# EAGLE design oresat0-mezzanine (EAGLE 9.6.2)

## Sheet 1 of 2: UHF
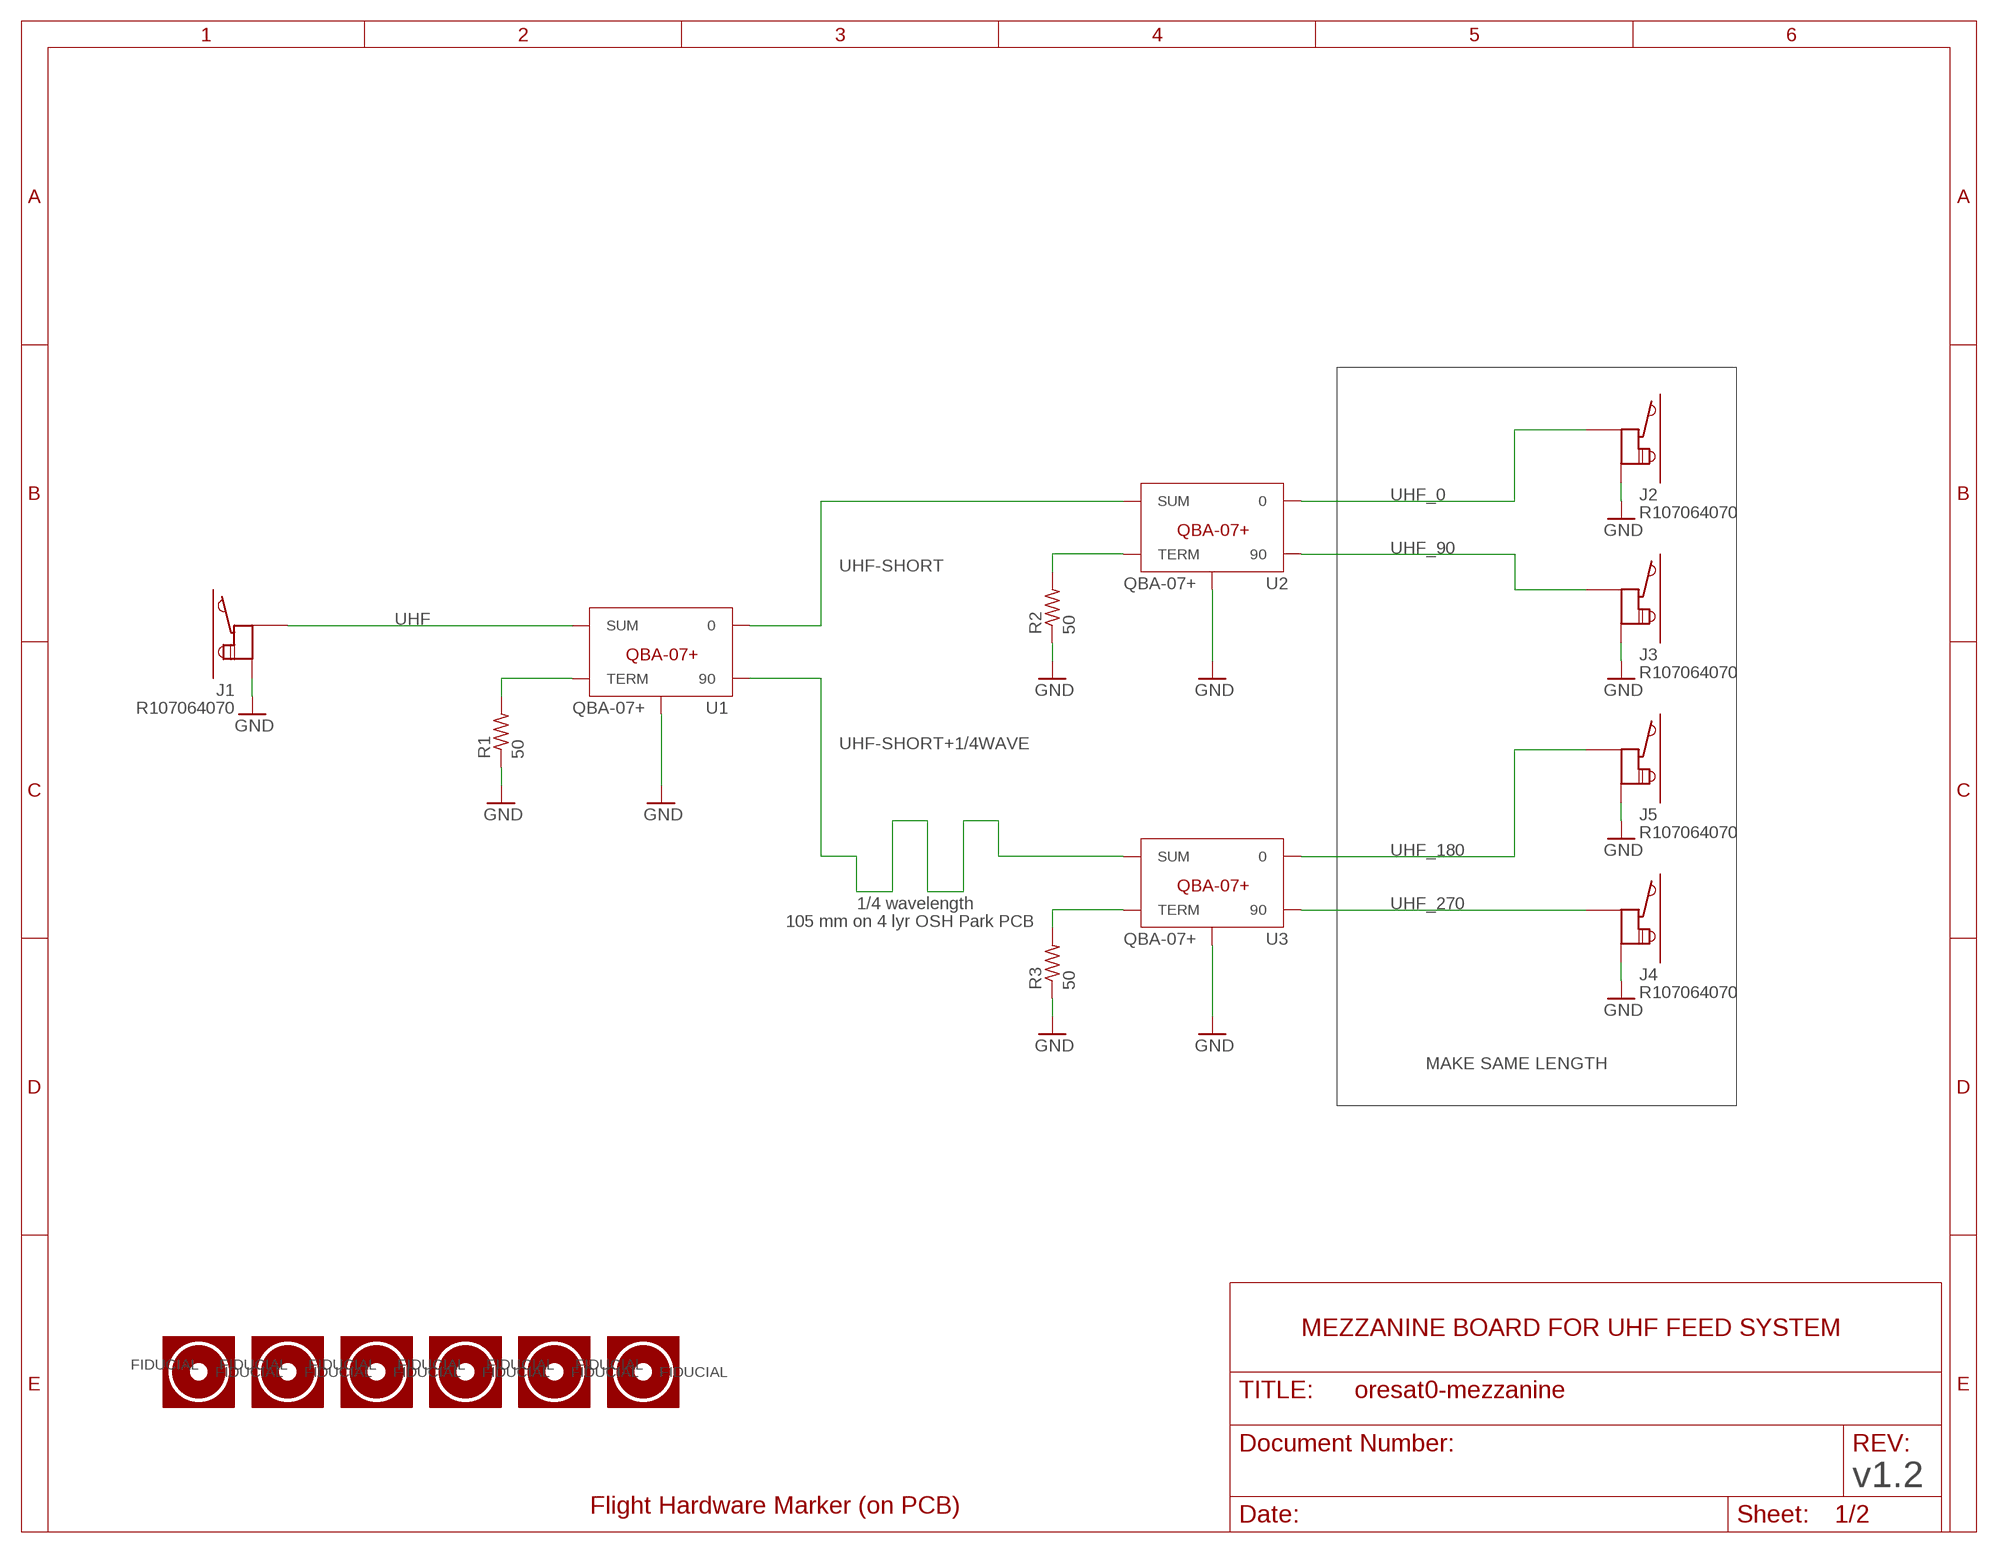
[diagram p0: schematic, sheet 1]

### Parts
FIDUCIAL1  FIDUCIAL-1.0X2.0  [FIDUCIAL-1.0X2.0]
FIDUCIAL2  FIDUCIAL-1.0X2.0  [FIDUCIAL-1.0X2.0]
FIDUCIAL3  FIDUCIAL-1.0X2.0  [FIDUCIAL-1.0X2.0]
FIDUCIAL4  FIDUCIAL-1.0X2.0  [FIDUCIAL-1.0X2.0]
FIDUCIAL6  FIDUCIAL-1.0X2.0  [FIDUCIAL-1.0X2.0]
FIDUCIAL7  FIDUCIAL-1.0X2.0  [FIDUCIAL-1.0X2.0]
J1  R107064070  [R107064070_SOLDER]
J2  R107064070  [R107064070_SOLDER]
J3  R107064070  [R107064070_SOLDER]
J4  R107064070  [R107064070_SOLDER]
J5  R107064070  [R107064070_SOLDER]
R1  50  R-US_0603-C-NOSILK  [.0603-C-NOSILK]
R2  50  R-US_0603-C-NOSILK  [.0603-C-NOSILK]
R3  50  R-US_0603-C-NOSILK  [.0603-C-NOSILK]
U1  QBA-07+  [QBA-07+]
U2  QBA-07+  [QBA-07+]
U3  QBA-07+  [QBA-07+]
U$1  FLIGHMARKERNEW  [FLIGHTMARKER_NEW_BOARDS]

### Nets
GND: J1.P$2 J1.P$3 J2.P$2 J2.P$3 J3.P$2 J3.P$3 J4.P$2 J4.P$3 J5.P$2 J5.P$3 R1.1 R2.1 R3.1 U1.2(GND) U1.3(GND) U1.4(GND) U1.7(GND) U1.8(GND) U1.9(GND) U1.GND-NO-PAD(GND) U2.2(GND) U2.3(GND) U2.4(GND) U2.7(GND) U2.8(GND) U2.9(GND) U2.GND-NO-PAD(GND) U3.2(GND) U3.3(GND) U3.4(GND) U3.7(GND) U3.8(GND) U3.9(GND) U3.GND-NO-PAD(GND) ; also sheet 2
N$3: R1.2 U1.5(TERM)
N$4: R2.2 U2.5(TERM)
N$6: R3.2 U3.5(TERM)
UHF [RF]: J1.P$1 U1.1(SUM)
UHF-SHORT [RF]: U1.6 U2.1(SUM)
UHF-SHORT+1/4WAVE [RF]: U1.10 U3.1(SUM)
UHF_0 [RF]: J2.P$1 U2.6
UHF_90 [RF]: J3.P$1 U2.10
UHF_180 [RF]: J5.P$1 U3.6
UHF_270 [RF]: J4.P$1 U3.10
Unconnected: FIDUCIAL1.FIDUCIAL FIDUCIAL2.FIDUCIAL FIDUCIAL3.FIDUCIAL FIDUCIAL4.FIDUCIAL FIDUCIAL6.FIDUCIAL FIDUCIAL7.FIDUCIAL

### Notes on the sheet
- 1/4 wavelength
- 105 mm on 4 lyr OSH Park PCB
- MAKE SAME LENGTH
- MEZZANINE BOARD FOR UHF FEED SYSTEM
- v1.2

## Sheet 2 of 2: S BAND
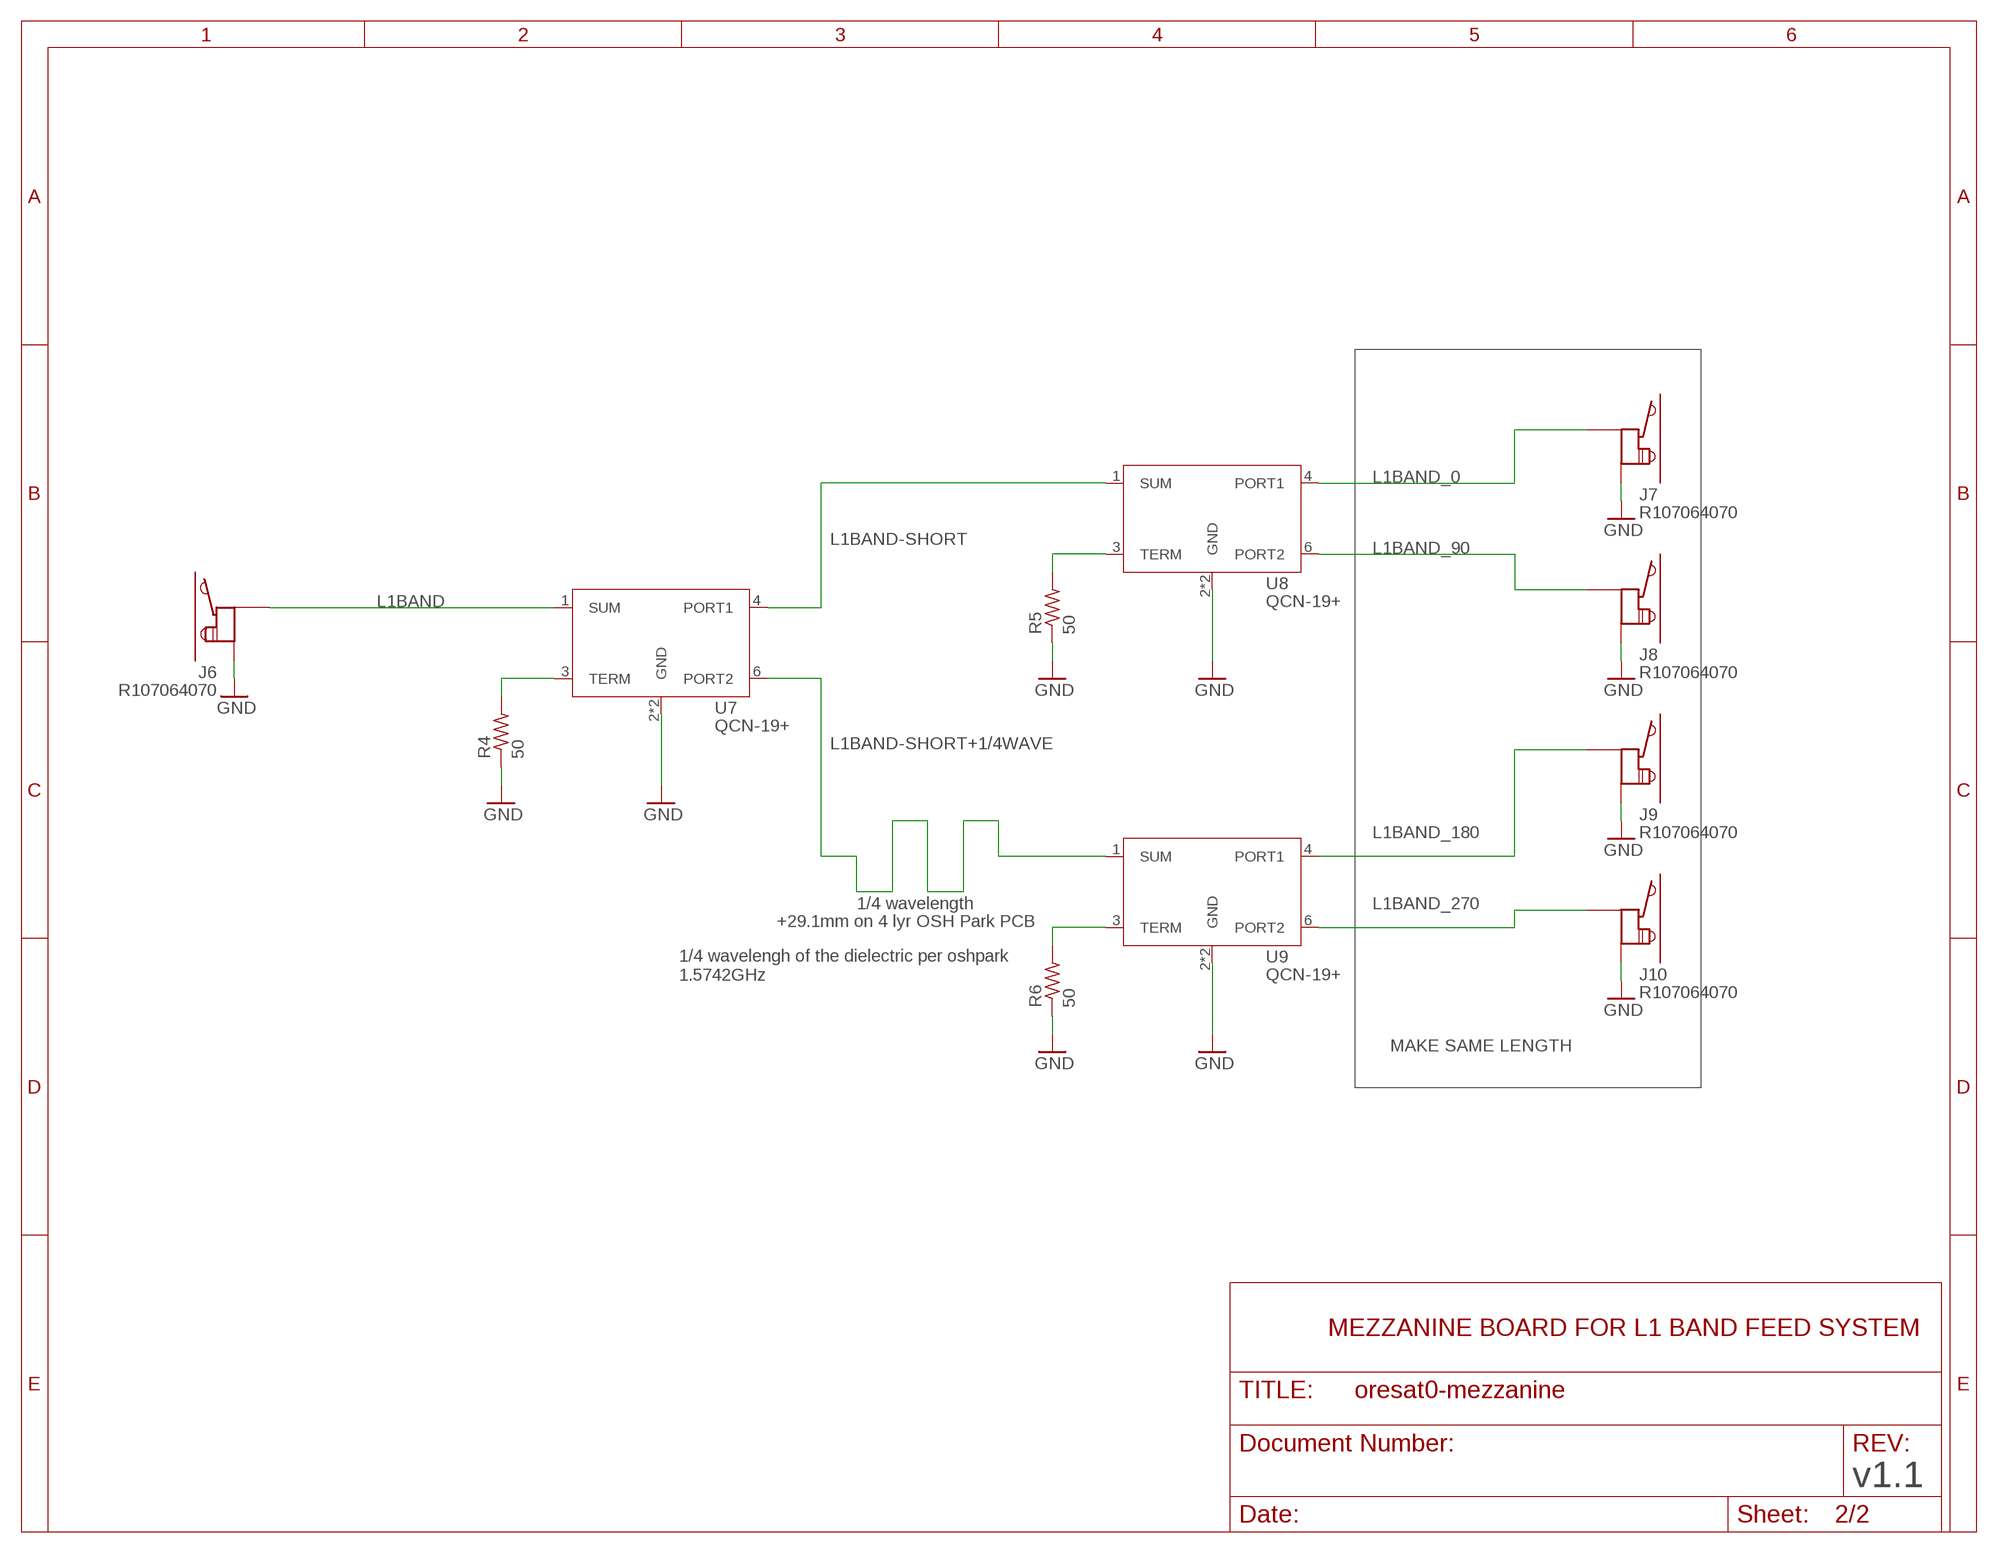
[diagram p1: schematic, sheet 2]

### Parts
J6  R107064070  [R107064070_SOLDER]
J7  R107064070  [R107064070_SOLDER]
J8  R107064070  [R107064070_SOLDER]
J9  R107064070  [R107064070_SOLDER]
J10  R107064070  [R107064070_SOLDER]
R4  50  R-US_0603-C-NOSILK  [.0603-C-NOSILK]
R5  50  R-US_0603-C-NOSILK  [.0603-C-NOSILK]
R6  50  R-US_0603-C-NOSILK  [.0603-C-NOSILK]
U7  QCN-19+  QCN-XXX+  [QCN-XXX+]
U8  QCN-19+  QCN-XXX+  [QCN-XXX+]
U9  QCN-19+  QCN-XXX+  [QCN-XXX+]

### Nets
GND: J6.P$2 J6.P$3 J7.P$2 J7.P$3 J8.P$2 J8.P$3 J9.P$2 J9.P$3 J10.P$2 J10.P$3 R4.1 R5.1 R6.1 U7.2(GND) U7.5(GND) U8.2(GND) U8.5(GND) U9.2(GND) U9.5(GND) ; also sheet 1
L1BAND [RF]: J6.P$1 U7.1(SUM)
L1BAND-SHORT [RF]: U7.4(PORT1) U8.1(SUM)
L1BAND-SHORT+1/4WAVE [RF]: U7.6(PORT2) U9.1(SUM)
L1BAND_0 [RF]: J7.P$1 U8.4(PORT1)
L1BAND_90 [RF]: J8.P$1 U8.6(PORT2)
L1BAND_180 [RF]: J9.P$1 U9.4(PORT1)
L1BAND_270 [RF]: J10.P$1 U9.6(PORT2)
N$1: R4.2 U7.3(TERM)
N$2: R5.2 U8.3(TERM)
N$5: R6.2 U9.3(TERM)

### Notes on the sheet
- 1/4 wavelength
- +29.1mm on 4 lyr OSH Park PCB
- 1/4 wavelengh of the dielectric per oshpark
  1.5742GHz
- MAKE SAME LENGTH
- MEZZANINE BOARD FOR L1 BAND FEED SYSTEM
- v1.1

## Library data of the parts
FIDUCIAL1-FIDUCIAL4 FIDUCIAL6 FIDUCIAL7 = monitor-v2-debug:FIDUCIAL: Fiducials for optical coordinate reference
J1-J10 = J-Radiall-R107064070-RF:R107064070: Surface to surface low percision RF connector R107064070 Datasheet: Datasheet <https://www.mouser.com/datasheet/2/516/radiall_radls10120-1-1746158.pdf>; DESCRIPTION: Surface to surface RF connector; DIST: Mouser; DIST_PN: 501-R107064070; GENERIC: N; MFG: Radiall; MFG_PN: R107064070; P-NP: P
R1-R6 = oresat-rcl:R-US_: RESISTOR, American symbol
U1-U3 = U-MiniCirc-QBA-07+_Phase-shifter:QBA-07+
U7-U9 = U-MiniCirc-QCN-XXX+-quad:QCN-XXX+: RF Power Splitter/Combiner, Quadrature Hybrid QCN-19+ 1100 - 1925 MHz Datasheet: Datasheet <https://www.minicircuits.com/pdfs/QCN-19+.pdf>; DESCRIPTION: Signal Conditioning LTCC 90 Hybrid, 1100-1925 MHz, 50 ohms; DIST: Mouser; DIST_PN: 139-QCN-19; GENERIC: N; MFG: Mini-Circuits; MFG_PN: QCN-19+; P-NP: P
U$1 = oresat-flight-marker:FLIGHMARKER

## Net classes
1 RF: width 0.38 mm, drill 0.38 mm, clearance 1 mm

## Board
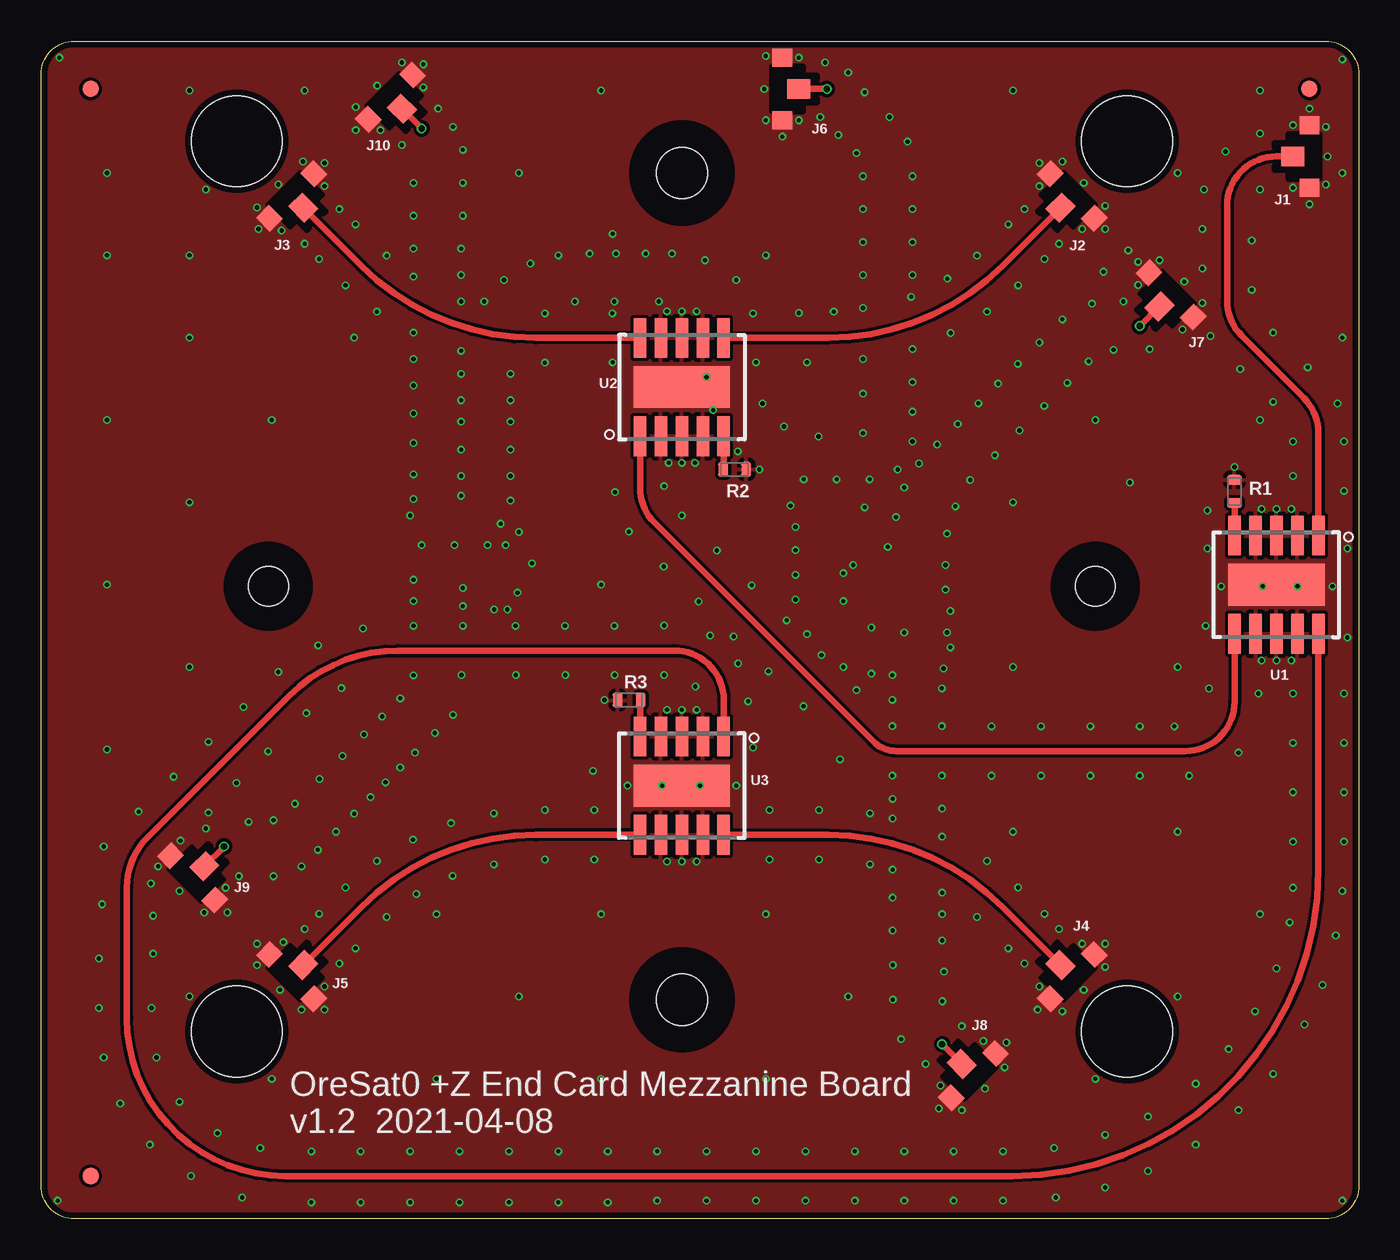
[diagram p2: board, top side]
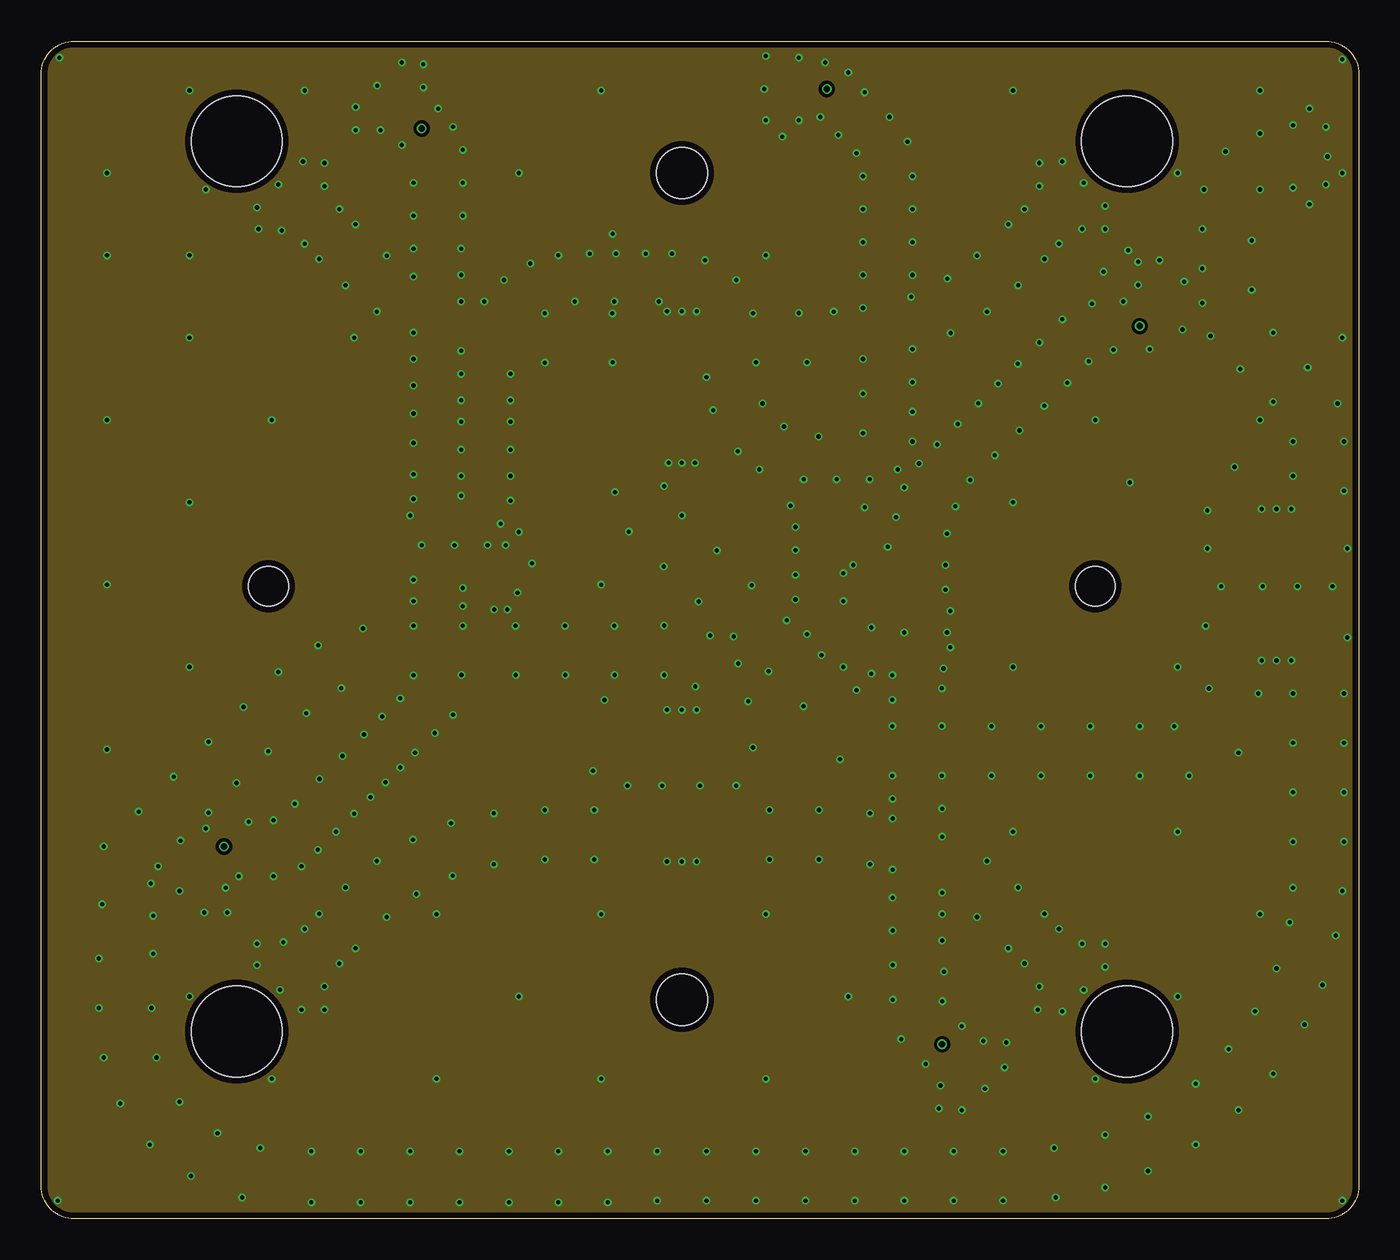
[diagram p3: board, inner layer Route2]
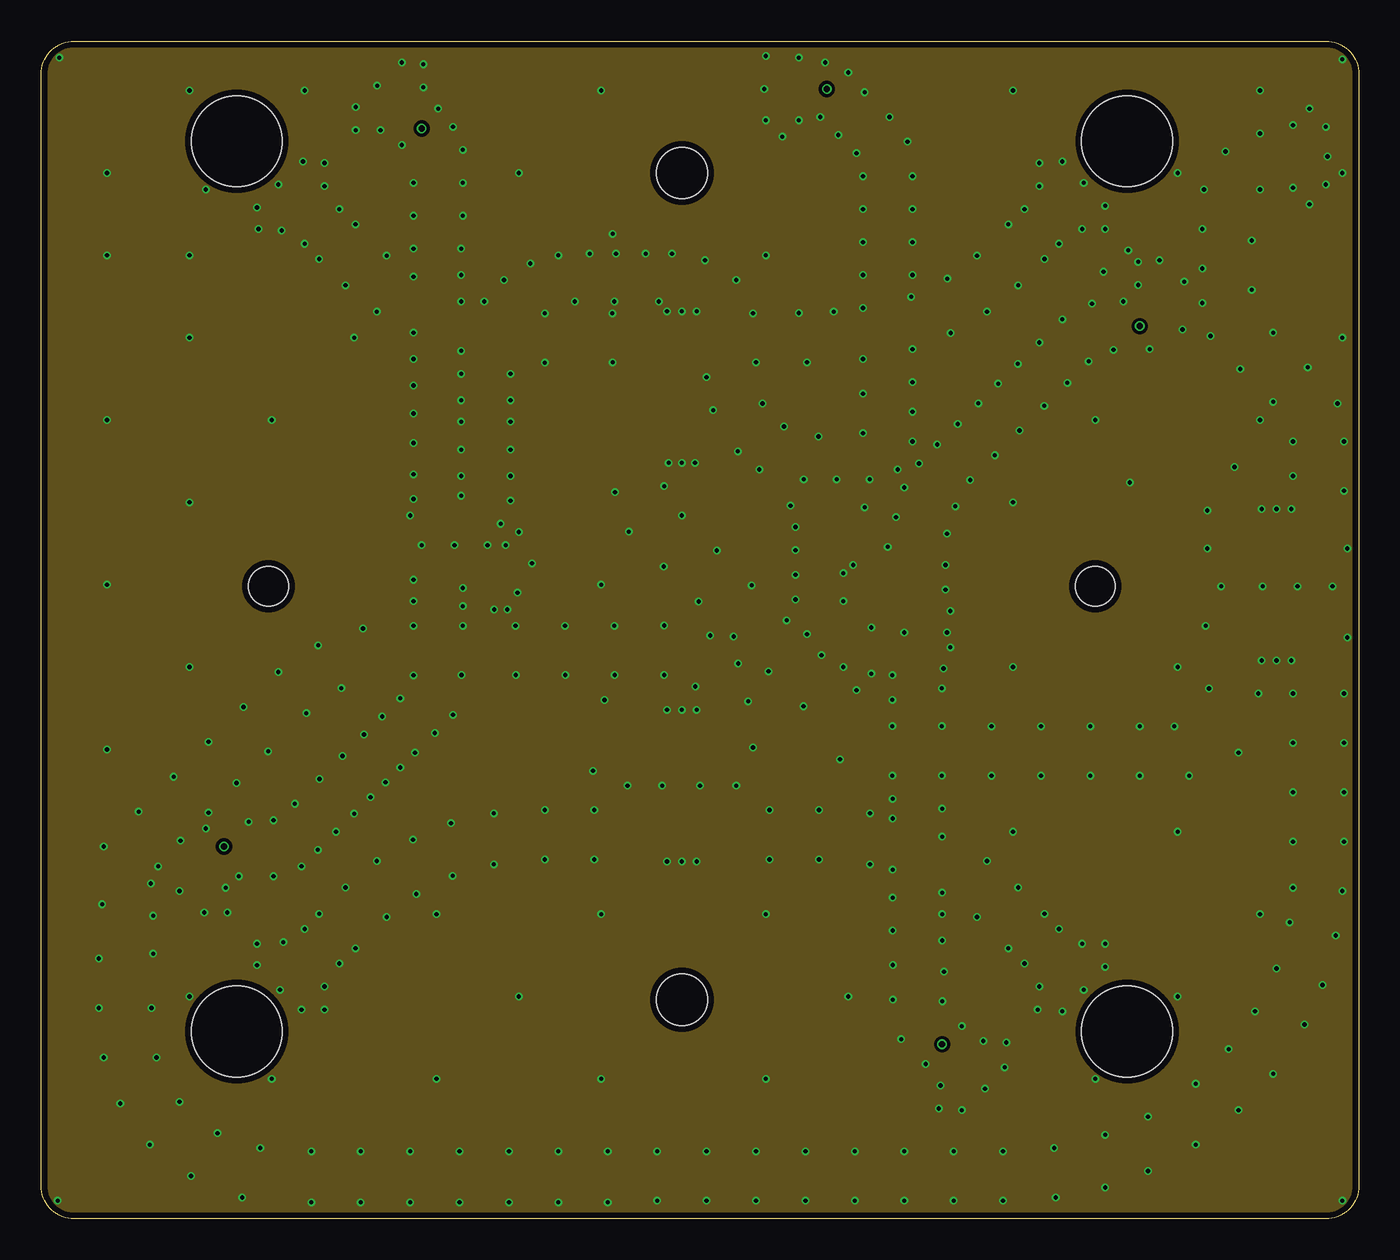
[diagram p4: board, inner layer Route15]
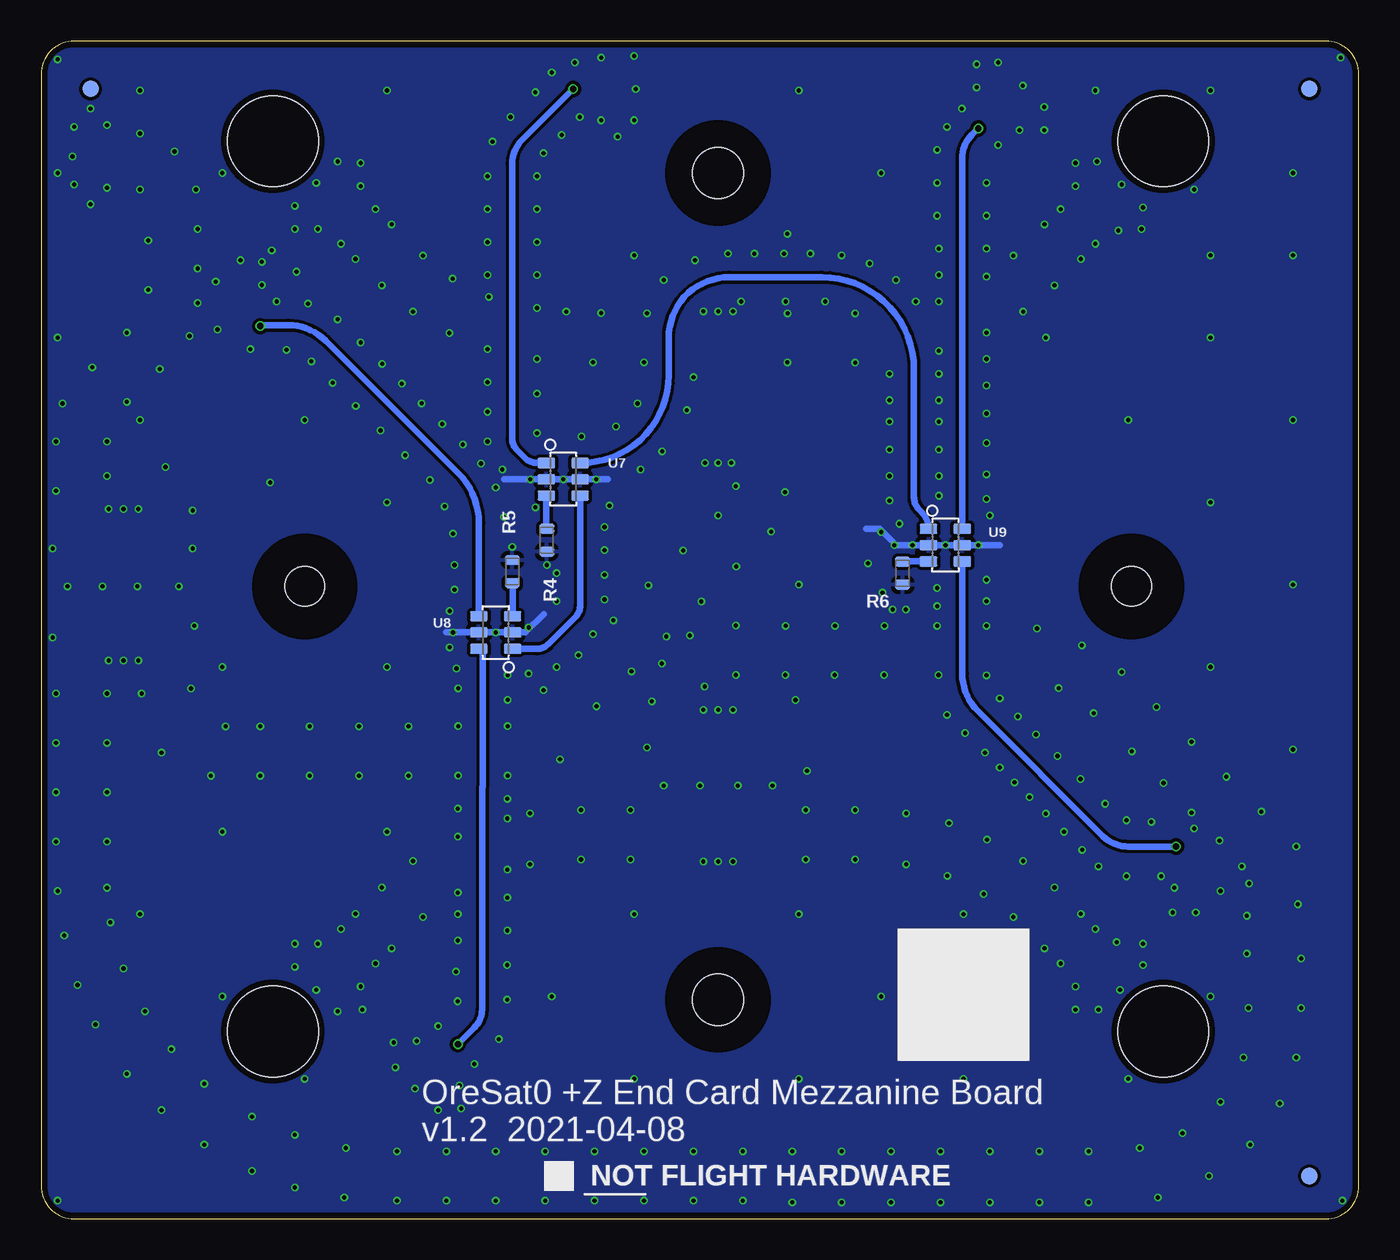
[diagram p5: board, bottom side, seen from below]

Size 80 x 71.5 mm. Coordinates in mm from the lower left corner, seen from the top.
Outline: 2,71.5 78,71.5 arc-90 80,69.5 80,2 arc-90 78,0 2,0 arc-90 0,2 0,69.5 arc-90 2,71.5
Copper layers (1*2*15*16): Top 0.035559375mm / dielectric 0.17018125mm / Route2 0.01778125mm / dielectric 47mil / Route15 0.01778125mm / dielectric 0.17018125mm / Bottom 0.035559375mm
Design rules "oshpark-4layer *": minimum track width 5mil, minimum drill 10mil, track to track 5mil, track to pad 5mil, pad to pad 5mil, via to via 5mil, smd to smd 5mil, copper to edge 15mil, drill to drill 6mil, minimum pad ring 4mil, minimum via ring 4mil, stop-mask expansion 2.5mil, vias tented up to drill 0.26mm, thermal gap 10mil
Holes 2.4 mm at 13.8,38.4 64,38.4
Holes 3.1 mm at 38.9,63.5 38.9,13.3
Holes 5.5 mm at 65.93,65.43 11.87,65.43 65.93,11.37 11.87,11.37
tRestrict: area 35.9,10.3 to 41.9,16.3; area 35.9,60.5 to 41.9,66.5; area 11.3,35.9 to 16.3,40.9; area 61.5,35.9 to 66.5,40.9
bRestrict: area 35.9,10.3 to 41.9,16.3; area 35.9,60.5 to 41.9,66.5; area 10.8,35.4 to 16.8,41.4; area 61,35.4 to 67,41.4; 3 lines

### Footprints (pad centres in the part's own frame; a part is rotated, then mirrored left to right if it is on the bottom)
FIDUCIAL-1.0X2.0 = smd 1 x 1: FIDUCIAL 0,0
R107064070_SOLDER = smd 1.2 x 1.4: P$1 0,-1 | smd 1.1 x 1.2: P$2 -1.9,0; P$3 1.9,0
.0603-C-NOSILK = smd 0.6 x 0.9: 1 -0.7,0; 2 0.7,0
QBA-07+ = smd 0.762 x 2.413: 1 -2.54,-2.985; 2 -1.27,-2.985; 3 0,-2.985; 4 1.27,-2.985; 5 2.54,-2.985; 6 2.54,2.985; 7 1.27,2.985; 8 0,2.985; 9 -1.27,2.985; 10 -2.54,2.985 | smd 5.84 x 2.54: GND-NO-PAD 0,0
QCN-XXX+ = smd 0.61 x 1.07: 1 -0.99,-1.025; 2 0,-1.025; 3 0.99,-1.025; 4 0.99,1.025; 5 0,1.025; 6 -0.99,1.025

### Placement (x,y rotation side)
FIDUCIAL1  3,2.6 0 bottom
FIDUCIAL2  3,2.6 0 top
FIDUCIAL3  3,68.6 0 top
FIDUCIAL4  77,68.6 0 top
FIDUCIAL6  3,68.6 0 bottom
FIDUCIAL7  77,68.6 0 bottom
J1  77,64.5 270 top
J2  62.6,62.1 315 top
J3  15.2,62.1 45 top
J4  62.6,14.7 225 top
J5  15.2,14.7 135 top
J6  45,68.6 90 top
J7  68.6,56.1 315 top
J8  56.6,8.7 225 top
J9  9.2,20.7 135 top
J10  21.21,68.1 45 top
R1  72.45,44.16 270 top
R2  42.1,45.5 180 top
R3  35.7,31.5 0 top
R4  49.3,41.2 90 bottom
R5  51.4,39.3 270 bottom
R6  27.7,39.2 90 bottom
U1  75,38.5 180 top
U2  38.9,50.5 0 top
U3  38.9,26.3 180 top
U7  48.3,44.9 270 bottom
U8  52.4,35.6 90 bottom
U9  25.1,40.9 270 bottom
U$1  49.2,2 0 bottom

### Tracks (layer width: path | path; a pad name or v marks a point on that pad's centre or on a via)
GND  (via drill 0.25)
  Bottom 0.38: 51.9,44.9 U7.2 U7.5 v46.3,44.9 45.6,44.9 | 55.4,35.6 U8.5 U8.2 50.6,35.6 49.5,36.7 | 21.8,40.9 U9.5 U9.2 v28.2,40.9 28.15,40.95 29.1,41.9 29.9,41.9
  other vias: 74,62.5 73.5,59.4 73.5,56.4 70.5,57.7 70.5,55.6 71.9,64.8 70.6,62.5 74,65.9 74.8,53.8 71,53.6 72.8,51.6 74.8,49.6 76.9,51.7 78.7,49.5 76,47.2 79.1,47.2 79.1,44.2 76,45.1 79.3,40.7 78.4,38.4 79.3,35.3 79.1,31.9 76,31.9 79.1,28.9 76,28.9 76,25.9 76,22.9 79.1,25.9 79.1,22.9 79,19.9 78.6,17.2 77.8,14.2 76.7,11.8 74.8,8.8 72.7,6.6 70.1,4.5 67.2,2.9 64.6,1.9 61.6,1.3 58.4,1.1 55.4,1.1 55.4,4.1 58.4,4.1 61.5,4.3 64.6,5.1 67.2,6.2 70.1,8.2 72.1,10.3 73.7,12.6 75,15.2 75.8,18 76,20.1 52.4,1.1 49.4,1.1 46.4,1.1 43.4,1.1 40.4,1.1 37.4,1.1 34.4,1 34.4,4.1 37.4,4.1 40.4,4.1 43.4,4.1 46.4,4.1 49.4,4.1 52.4,4.1 31.4,1 31.4,4.1 28.4,4.1 25.4,4.1 22.4,4.1 28.4,1 25.4,1 22.4,1 19.4,1 16.4,1 16.4,4.1 19.4,4.1 13.3,4.3 10.7,5.2 8.4,7.1 7,9.8 6.7,12.8 6.8,16.1 3.5,15.8 3.5,12.8 3.8,9.8 4.8,7 6.6,4.5 9.1,2.6 12.2,1.3 6.8,18.4 3.7,19.1 3.8,22.6 5.92,24.72 8.04,26.84 10.16,28.96 12.28,31.08 14.4,33.2 16.82,34.82 19.54,35.84 11.86,26.46 13.78,28.38 16.1,30.7 18.22,32.22 25.52,33.02 25.6,36 28.8,36 28.82,33.02 31.8,36 34.8,36 37.82,36.02 31.82,33.02 34.82,33.02 37.82,33.02 39.72,32.32 40.62,35.42 42.32,33.72 42.92,31.42 42.2,26.3 43.22,28.62 44.22,24.82 44.22,21.82 47.22,21.82 47.22,24.82 50.32,21.52 50.32,24.62 57.42,21.72 56.82,18.32 58.72,16.42 59.32,20.12 60.92,18.52 73.9,31.9 70.9,32.2 68.8,29.9 72.7,28.3 69.7,26.9 66.7,26.9 66.7,29.9 63.7,26.9 63.7,29.9 60.7,29.9 57.7,29.9 51.68,29.91 60.7,26.9 57.7,26.9 51.68,26.91 48.5,27.9 49.5,32.1 46.28,31.12 44.16,33.24 42.04,35.36 39.92,37.48 37.8,39.6 35.68,41.72 47.38,34.22 45.26,36.34 43.14,38.46 41.02,40.58 38.9,42.7 37.82,44.48 34.84,44.12 35.6,26.3 37.7,26.3 40,26.3 76.28,38.4 74.16,38.4 71.64,38.4 34.68,54.98 30.58,54.98 30.58,51.98 20.38,55.08 20.98,58.48 19.08,60.38 18.48,56.68 16.88,58.28 10,62.5 16,68.5 23.2,68.7 34,68.5 43.9,68.6 74,68.5 79,63.5 79,53.5 66.1,44.7 64,48.5 69,63.5 69.3,54 74,48.5 59,33.5 69,33.5 59,43.5 44,58.5 34.7,59.8 29,63.5 9,53.5 4,48.5 4,38.5 9,43.5 14,48.5 19,53.5 9,33.5 4,28.5 34,38.5 9,13.5 14,8.5 24,18.5 29,13.5 24,8.5 34,8.5 34,18.5 44,18.5 49,13.5 44,8.5 54.6,8.1 64,8.5 69,13.5 74,18.5 69,23.5 59,23.5 46,55 43.22,54.98 48.12,55.08 52.82,55.98 52.9,50.8 55.22,53.78 57.42,55.08 55.02,57.08 56.82,58.48 58.72,60.38 59.32,56.68 60.92,58.28 33.58,24.82 33.58,21.82 30.58,21.82 30.58,24.82 27.48,21.52 27.48,24.62 24.98,20.82 24.88,24.02 22.58,23.02 20.38,21.72 22.78,19.72 20.98,18.32 19.08,16.42 18.48,20.12 16.88,18.52 50.3,44.9 49.3,39.7 50.4,35.9 55,35.6 28.92,38.02 49.9,52.2 49.9,47.7 52.9,49 52.9,47.2 52,45.5 49.9,50.1 49.9,55.3 52.9,52.8 51.68,33.01 50.4,33.1 48.7,33.5 46.5,35.5 45.8,37.6 45.8,39.1 45.8,40.6 45.8,42 45.5,43.3 48.7,37.5 48.7,39.2 38.9,55.1 38,55.1 38.1,45.9 38.9,45.9 39.7,45.9 39.8,55.1 25.5,43.9 25.5,45.1 25.5,46.7 25.5,48.4 25.5,49.7 25.5,51.3 25.5,52.7 25.5,55.7 25.5,57.3 25.5,58.9 25.6,60.9 15.9,64.2 17.2,64.1 17.2,62.7 14.4,62.8 13.1,61.4 14.6,60 13.2,60.1 22.6,58.9 22.6,57.2 22.6,53.8 22.6,52.2 22.6,50.6 22.6,48.9 22.6,47.1 22.6,45.2 22.6,43.7 22.4,42.7 22.6,38.8 22.6,37.5 22.6,36 22.6,33 21.8,31.6 20.7,30.5 19.6,29.4 18.3,28.1 16.9,26.7 15.4,25.2 14.1,24.2 25.6,38.3 25.6,37.2 25,30.6 23.9,29.5 22.7,28.3 21.8,27.4 20.9,26.5 20,25.6 19,24.6 17.9,23.5 16.8,22.4 15.8,21.4 8.4,19.9 11.3,18.6 9.9,18.6 17.2,14.1 17.2,12.7 15.8,12.7 14.5,13.9 13.1,15.4 13.1,16.7 14.7,16.8 51.7,25.5 51.7,24.3 51.7,21.2 51.7,19.5 51.7,17.5 51.71,15.41 54.71,13.21 54.81,15.01 54.7,16.9 54.7,18.5 54.7,19.8 54.7,23.2 54.7,24.9 54.68,26.91 54.68,29.91 54.68,32.21 54.78,33.41 55.2,34.7 63.2,16.7 64.6,16.7 64.6,15.3 63.3,13.9 62,12.6 60.5,12.7 60.6,14.1 57.2,10.8 58.5,9.2 58.6,10.7 55.2,36.9 54.9,38.2 54.9,39.7 55,41.6 55.5,43.26 56.4,44.86 57.9,46.36 59.4,47.86 60.9,49.36 62.3,50.76 63.6,52.06 65.1,52.76 53.3,45.86 54.4,47.01 55.65,48.26 56.9,49.51 58.1,50.71 59.3,51.91 60.6,53.21 62,54.61 63.8,55.56 69.4,56.9 66,58.8 64.5,57.5 63.2,60.1 64.6,60.1 64.6,61.5 63.3,62.9 62,64.2 60.6,64.1 60.6,62.7 43.6,45.5 72.45,45.65 78,62.8 78.1,64.5 78,66.3 77,67.4 76,66.4 76,62.6 77,61.6 38.9,21.7 39.8,21.7 38,21.7 38.9,30.9 39.8,30.9 38,30.9 34.2,31.5 33.5,27.2 75,33.9 75.9,33.9 74.1,33.9 75,43.1 75.9,43.1 74.1,43.1 70.8,43 70.7,36 70.8,40.7 28.3,37 27.5,37 51.4,40.8 29,41.7 29.8,39.8 1,1.1 79,1.1 79,70.4 1.1,70.5 10.16,24.66 8.46,22.96 6.66,20.36 54.5,6.7 55.9,6.6 57.3,7.9 53.7,9.4 7.1,21.4 12.6,24.1 10,23.7 18.1,61.3 16,59.2 16,17.6 18.1,15.5 61.8,17.6 59.7,15.5 44,70.6 46,70.5 44,66.7 46,66.7 45,65.7 47.3,66.9 47.6,70.2 61.8,59.2 59.7,61.3 27.1,40.9 25.1,40.9 23.1,40.9 48.3,44.9 52.4,35.6 23.2,70.1 21.9,70.2 20.4,68.8 19.1,67.5 19.1,66.1 20.6,66.1 21.9,65.2 24.1,67.4 14.1,20.8 12,20.8 11.2,20.1 49.9,57.3 49.9,59.3 49.9,61.3 49.9,63.3 52.9,63.3 52.9,61.3 52.9,59.3 52.9,57.3 49.5,64.7 48.4,65.8 52.6,65.4 51.5,66.9 50,68.4 49,69.6 50,43.2 51.9,42.6 52.4,44.4 65.7,55.7 67.3,52.8 66.6,58.1 66.6,56.7 67.9,58.2 70.5,60.1 51.68,31.51 51.71,13.31 52.21,10.91 55.9,11.7 25.6,62.9 25.6,64.9 25,66.3 22.6,60.9 22.6,62.9 9,58.5 4,58.5 4,63.5 9,68.5 59,68.5 28.5,43.6 28.5,45.1 28.5,46.7 28.5,48.4 28.5,49.7 28.5,51.3 27.9,42.2 26.9,55.7 28.1,57 29.7,58 31.4,58.5 33.3,58.6 34.9,58.6 36.7,58.6 38.3,58.6 40.3,58.2 42.2,57 46.5,52 43.4,52 43.8,49.5 45.1,48.1 47.2,47.5 42.3,46.6 40.8,49.1 40.4,51.1 34.7,52 32.4,55.7 34.8,55.7 37.5,55.7
  pour Top (isolate 0.2, rank 6): 0,71.5 0,0 80,0 80,71.5
  pour Route2 (isolate 0.2, rank 6, no thermals): 0,71.5 0,0 80,0 80,71.5
  pour Route15 (isolate 0.2, rank 6, no thermals): 0,71.5 0,0 80,0 80,71.5
  pour Bottom (isolate 0.2, rank 6): 0,71.5 0,0 80,0 80,71.5
L1BAND  (via drill 0.38)
  Top 0.38: J6.P$1 v47.7,68.6
  Bottom 0.38: v47.7,68.6 50.81,65.49 arc-45 51.4,64.07 51.4,47.38 arc-45 51.11,46.67 50.62,46.18 arc-45 49.91,45.89 U7.1
L1BAND-SHORT
  Bottom 0.38: U7.4 47.27,37.24 arc45 47.57,36.53 49.2,34.9 arc45 49.9,34.61 U8.1
L1BAND-SHORT+1/4WAVE
  Bottom 0.38: 47.27,45.95 U7.6 47.24,45.89 arc-90 41.9,51.23 41.9,53.5 arc90 38.23,57.17 32.61,57.17 arc90 27.01,51.57 27.01,43.8 arc-45 26.71,43.07 26.62,42.98 26.55,42.91 arc45 U9.1
L1BAND_0  (via drill 0.38)
  Top 0.38: J7.P$1 v66.7,54.2
  Bottom 0.38: v66.7,54.2 66.64,54.26 65.01,54.26 arc45 62.73,53.32 54.67,45.25 arc45 53.42,42.25 U8.4
L1BAND_90  (via drill 0.38)
  Top 0.38: J8.P$1 v54.7,10.6 | v54.7,10.6
  Bottom 0.38: v54.7,10.6 53.69,11.61 arc-45 53.23,12.7 53.21,16.49 53.21,26.23 53.2,26.23 53.2,34.42 53.39,34.61 U8.6
L1BAND_180  (via drill 0.38)
  Top 0.38: v11.1,22.6 J9.P$1
  Bottom 0.38: U9.4 24.08,33.1 arc-45 23.14,30.84 15.54,23.24 arc-45 14,22.6 v11.1,22.6
L1BAND_270  (via drill 0.38)
  Top 0.38: J10.P$1 v23.1,66.21 v23.1,66.2
  Bottom 0.38: U9.6 24.08,64.41 arc45 23.49,65.83 23.12,66.2 v23.1,66.2
N$1
  Bottom 0.38: U7.3 49.33,42.12 R4.2
N$2
  Bottom 0.38: U8.3 51.38,38.38 R5.2
N$3
  Top 0.38: R1.2 U1.5
N$4
  Top 0.38: U2.5 41.44,45.54 R2.2
N$5
  Bottom 0.38: U9.3 R6.2
N$6
  Top 0.38: 36.36,31.46 R3.2 36.36,31.46 | U3.5 36.36,31.46
UHF
  Top 0.38: J1.P$1 75,64.5 arc90 72,61.5 72,55.74 arc45 72.88,53.62 76.66,49.84 arc-45 77.54,47.72 U1.1
UHF-SHORT
  Top 0.38: U1.6 72.46,31.4 arc-90 69.46,28.4 51.93,28.4 arc-45 50.51,28.99 37.24,42.26 arc-45 36.36,44.38 U2.1
UHF-SHORT+1/4WAVE
  Top 0.38: U1.10 77.54,21.18 arc-90 58.96,2.6 14.79,2.6 arc-90 5.2,12.19 5.2,20.12 arc-45 6.46,23.16 15.06,31.76 arc-45 21.68,34.5 38.44,34.5 arc-90 41.44,31.5 U3.1
UHF_0
  Top 0.38: U2.6 47.77,53.49 arc45 58.38,57.88 J2.P$1
UHF_90
  Top 0.38: U2.10 30.03,53.49 arc-45 19.42,57.88 J3.P$1
UHF_180
  Top 0.38: J5.P$1 19.42,18.92 arc-45 30.03,23.32 U3.6
UHF_270
  Top 0.38: U3.10 47.77,23.32 arc-45 58.38,18.92 J4.P$1

### Text on the board
bPlace: OreSat0 +Z End Card Mezzanine Board / v1.2 2021-04-08
tNames: OreSat0 +Z End Card Mezzanine Board / v1.2 2021-04-08